# Altium schematic sheet Res 174K 805.schdoc
size 44 x 27 mm
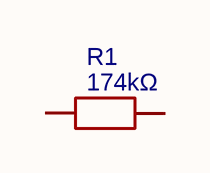
[diagram p0: Res 174K 805.schdoc]

## Parts
R1  174kΩ  [R0805]

## Nets

Not connected (* = marked no-connect by the designer): R1 1 2

## Library data of the parts
R1 = 174kΩ: Manufacturer: PANASONIC(松下); Manufacturer Part: ERJ6ENF1743V; nameAlias: Value; Contributor: LCSC; Supplier: LCSC; Supplier Part: C409978; JLCPCB Part Class: Extended Part; spicePre: R; spiceSymbolName: ERJ6ENF1743V